# Altium schematic sheet Temp Sense.SchDoc: Temprature Sensor Circuit
size A3; Engineer: A. SHAW; Organization: BLUEsat Project; Address1: Room 419; Address2: School of EE&T; Address3: UNSW, NSW 2052; Address4: Australia; DocumentNumber: TELM0003; SheetNumber: 1; SheetTotal: 1; Description: Converts Temperature to 10mV/K; Version: 1.0
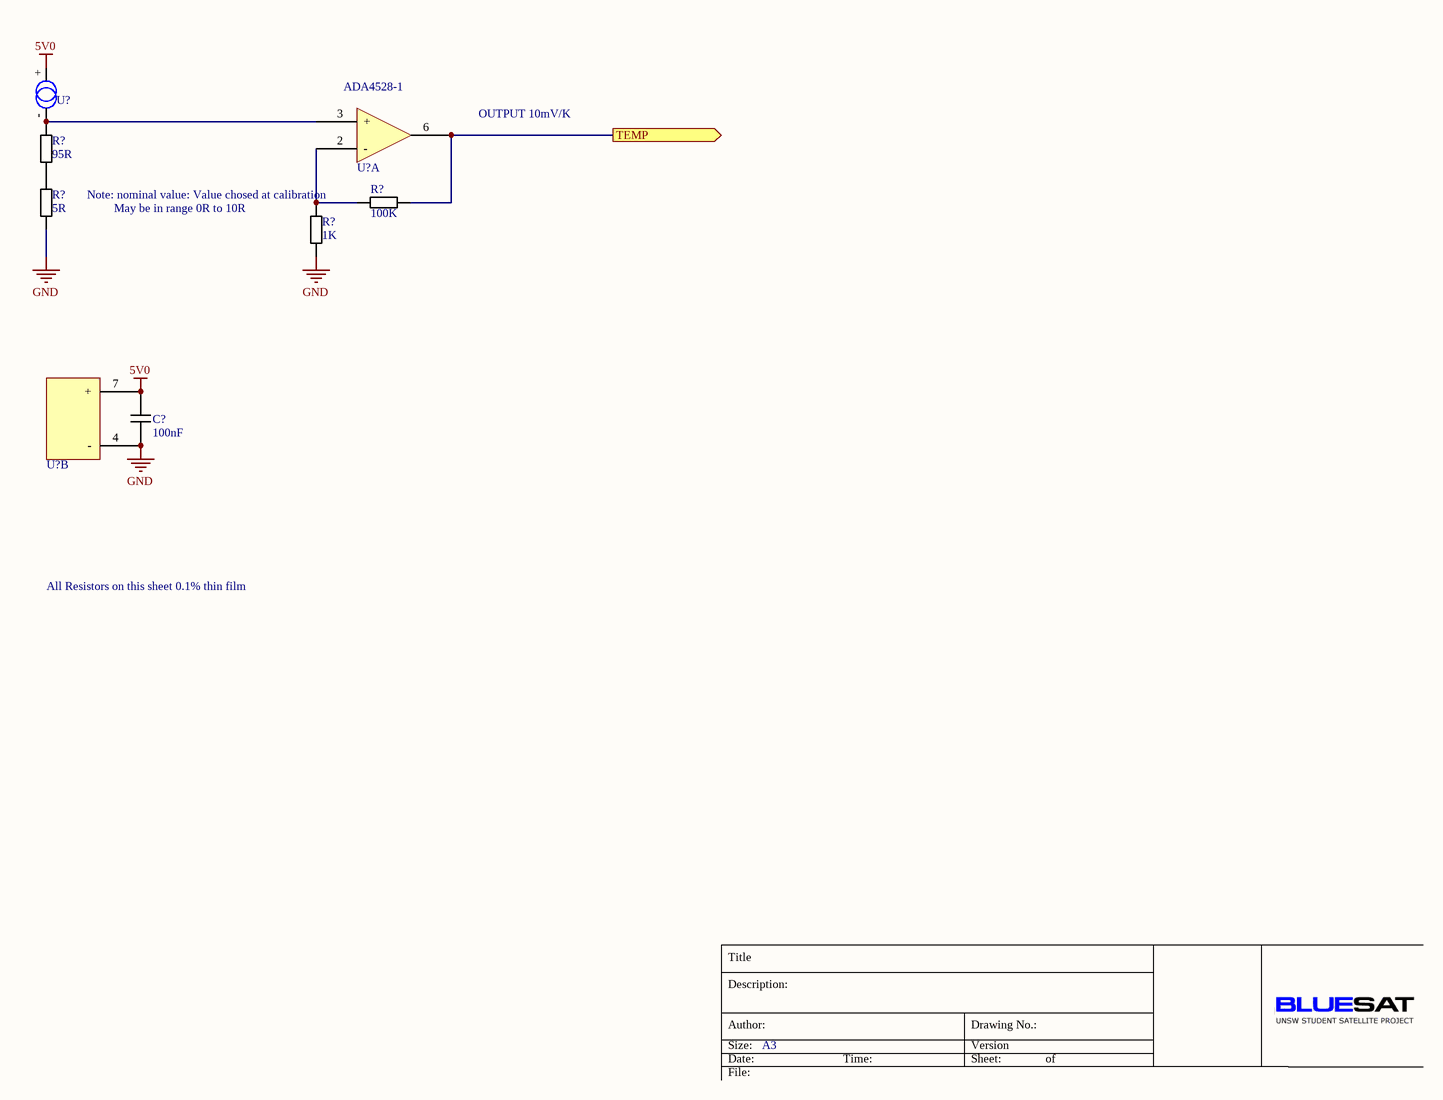
[diagram p0: Temp Sense.SchDoc]

## Parts
(Parts that share a designator on the sheet are numbered #1, #2 ... from top to bottom, then left to right.)
C?  value 100nF  [0805 Cap]  (hidden comment: 0805 Cap)
R?#1  value 95R  [0603 Resistor]  (hidden comment: 0603 Resistor)
R?#2  value 5R  [0603 Resistor]  (hidden comment: 0603 Resistor)
R?#3  value 100K  [0603 Resistor]  (hidden comment: 0603 Resistor)
R?#4  value 1K  [0603 Resistor]  (hidden comment: 0603 Resistor)
U?#1  AD590KF  (value not drawn)
U?#2  ADA4528-1  [SOIC8 - LME49720]  (part A of 2)
U?#3  ADA4528-1  [SOIC8 - LME49720]  (value not drawn)  (part B of 2)

## Ports
TEMP (out)

## Nets
5V0: C?.2 U?#1.+ U?#3.7(+)
GND: C?.1 R?#2.1 R?#4.1 U?#3.4(-)
TEMP: R?#3.1 U?#2.6(Out) ; port TEMP
NetR?#1_1: R?#1.1 R?#2.2
NetR?#1_2: R?#1.2 U?#1.- U?#2.3(+)
NetR?#3_2: R?#3.2 R?#4.2 U?#2.2(-)

## Notes on the sheet
- OUTPUT 10mV/K
- (near R?#3) Note: nominal value: Value chosed at calibration
- (near R?#4) May be in range 0R to 10R
- All Resistors on this sheet 0.1% thin film
- Title
- Description:
- Size:
- Author:
- Date:
- A3
- Time:
- Version
- Sheet:
- Drawing No.:
- of
- File:

## Library data of the parts
C? = 0805 MLCC - X7R, 10%
R?#1-R?#4 = 0603 Thin Film Resistor 0.1%
U?#1 = AD590KF: Temperature sensor IC
U?#2 U?#3 = ADA4528-1: Dual, High Performance Audio Operational Amplifier; ComponentLink1Description: Datasheet; ComponentLink1URL: http://www.national.com/ds/LM/LME49720.pdf